# Altium schematic sheet SDRAM.SchDoc
size Tabloid; ApprovedBy: NA
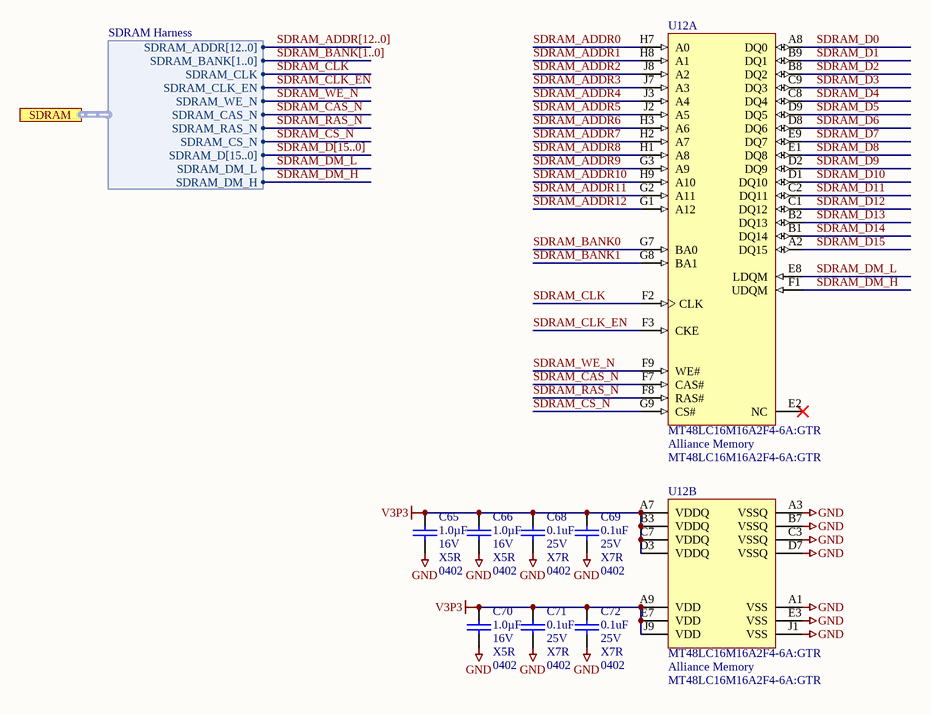
[diagram p0: SDRAM.SchDoc]

## Parts
C65  Capacitance: 1.0µF  Voltage - Rated: 16V  Temperature Coefficient: X5R  Package / Case: 0402  [C_0402]  (hidden comment: 1.0uF)
C66  Capacitance: 1.0µF  Voltage - Rated: 16V  Temperature Coefficient: X5R  Package / Case: 0402  [C_0402]  (hidden comment: 1.0uF)
C68  Capacitance: 0.1uF  Voltage - Rated: 25V  Temperature Coefficient: X7R  Package / Case: 0402  [C_0402]  (hidden comment: C_0402_0.1UF_25V)
C69  Capacitance: 0.1uF  Voltage - Rated: 25V  Temperature Coefficient: X7R  Package / Case: 0402  [C_0402]  (hidden comment: C_0402_0.1UF_25V)
C70  Capacitance: 1.0µF  Voltage - Rated: 16V  Temperature Coefficient: X5R  Package / Case: 0402  [C_0402]  (hidden comment: 1.0uF)
C71  Capacitance: 0.1uF  Voltage - Rated: 25V  Temperature Coefficient: X7R  Package / Case: 0402  [C_0402]  (hidden comment: C_0402_0.1UF_25V)
C72  Capacitance: 0.1uF  Voltage - Rated: 25V  Temperature Coefficient: X7R  Package / Case: 0402  [C_0402]  (hidden comment: C_0402_0.1UF_25V)
U12  MT48LC16M16A2F4-6A:GTR  Manufacturer 1: Alliance Memory  [MICT-B4-54]  (parts A,B of 2)

## Ports
SDRAM (harness SDRAM Harness)

## Harnesses
SDRAM Harness: SDRAM_ADDR[12..0], SDRAM_BANK[1..0], SDRAM_CLK, SDRAM_CLK_EN, SDRAM_WE_N, SDRAM_CAS_N, SDRAM_RAS_N, SDRAM_CS_N, SDRAM_D[15..0], SDRAM_DM_L, SDRAM_DM_H

## Nets
GND: C65.1 C66.1 C68.1 C69.1 C70.1 C71.1 C72.1 U12.A1(VSS) U12.A3(VSSQ) U12.B7(VSSQ) U12.C3(VSSQ) U12.D7(VSSQ) U12.E3(VSS) U12.J1(VSS)
V3P3: C65.2 C66.2 C68.2 C69.2 C70.2 C71.2 C72.2 U12.A7(VDDQ) U12.A9(VDD) U12.B3(VDDQ) U12.C7(VDDQ) U12.D3(VDDQ) U12.E7(VDD) U12.J9(VDD)
SDRAM_ADDR0: U12.H7(A0)
SDRAM_ADDR1: U12.H8(A1)
SDRAM_ADDR2: U12.J8(A2)
SDRAM_ADDR3: U12.J7(A3)
SDRAM_ADDR4: U12.J3(A4)
SDRAM_ADDR5: U12.J2(A5)
SDRAM_ADDR6: U12.H3(A6)
SDRAM_ADDR7: U12.H2(A7)
SDRAM_ADDR8: U12.H1(A8)
SDRAM_ADDR9: U12.G3(A9)
SDRAM_ADDR10: U12.H9(A10)
SDRAM_ADDR11: U12.G2(A11)
SDRAM_ADDR12: U12.G1(A12)
SDRAM_BANK0: U12.G7(BA0)
SDRAM_BANK1: U12.G8(BA1)
SDRAM_CAS_N: U12.F7(CAS#) ; port SDRAM.SDRAM_CAS_N
SDRAM_CLK: U12.F2(CLK) ; port SDRAM.SDRAM_CLK
SDRAM_CLK_EN: U12.F3(CKE) ; port SDRAM.SDRAM_CLK_EN
SDRAM_CS_N: U12.G9(CS#) ; port SDRAM.SDRAM_CS_N
SDRAM_D0: U12.A8(DQ0)
SDRAM_D1: U12.B9(DQ1)
SDRAM_D2: U12.B8(DQ2)
SDRAM_D3: U12.C9(DQ3)
SDRAM_D4: U12.C8(DQ4)
SDRAM_D5: U12.D9(DQ5)
SDRAM_D6: U12.D8(DQ6)
SDRAM_D7: U12.E9(DQ7)
SDRAM_D8: U12.E1(DQ8)
SDRAM_D9: U12.D2(DQ9)
SDRAM_D10: U12.D1(DQ10)
SDRAM_D11: U12.C2(DQ11)
SDRAM_D12: U12.C1(DQ12)
SDRAM_D13: U12.B2(DQ13)
SDRAM_D14: U12.B1(DQ14)
SDRAM_D15: U12.A2(DQ15)
SDRAM_DM_H: U12.F1(UDQM) ; port SDRAM.SDRAM_DM_H
SDRAM_DM_L: U12.E8(LDQM) ; port SDRAM.SDRAM_DM_L
SDRAM_RAS_N: U12.F8(RAS#) ; port SDRAM.SDRAM_RAS_N
SDRAM_WE_N: U12.F9(WE#) ; port SDRAM.SDRAM_WE_N

Not connected (* = marked no-connect by the designer): U12 E2(NC)*

## Buses and harness runs
bus SDRAM_ADDR[12..0]
bus SDRAM_BANK[1..0]
bus SDRAM_D[15..0]

## Notes on the sheet
- Project:
- http://www.cospandesign.com
- Cospan Design
- Document:
- Engineer:
- Title:
- Client:
- Approved By:
- Revision:
- Date:
- Number:
- of

## Library data of the parts
C65 C66 C70 = C_0402_1.0UF_16V: CAP CER 1.0UF 16V X5R 0402; Manufacturer 1: Samsung; Manufacturer Part Number 1: CL05A105KO5NNNC; Description 1: Cap Ceramic 1uF 16V X5R 10% SMD 0402 85C Paper T/R; Tolerance: 10%; ComponentLink1URL: http://ds.yuden.co.jp/TYCOMPAS/ut/detail.do?productNo=EMK105BJ105KV-F&fileName=EMK105BJ105KV-F_SS&mode=specSheetDownload; ComponentLink1Description: http://ds.yuden.co.jp/TYCOMPAS/ut/detail.do?productNo=EMK105BJ105KV-F&fileName=EMK105BJ105KV-F_SS&mode=specSheetDownload; ComponentLink2URL: https://datasheet.ciiva.com/16207/cl05a105ko5nnnc-16207571.pdf; ComponentLink2Description: https://datasheet.ciiva.com/16207/cl05a105ko5nnnc-16207571.pdf; ComponentLink3URL: https://datasheet.ciiva.com/15195/getdatasheetpartid-355272-15195629.pdf; ComponentLink3Description: https://datasheet.ciiva.com/15195/getdatasheetpartid-355272-15195629.pdf; Supplier 1: Digi-Key; Supplier Part Number 1: 1276-1067-6-ND; Stock 1: 26908; Pricing 1: 1=0.1, 10=0.062, 100=0.0276, 500=0.01968, 1000=0.01547, 2500=0.01406, 5000=0.01294 (USD); Mount: Surface Mount; Case/Package: 0402; Case Code (Metric): 1005; Case Code (Imperial): 0402; Contact Plating: Tin; Min Operating Temperature: -55°C; Max Operating Temperature: 85°C; Dielectric: X5R; Packaging: Tape and Reel; Package Quantity: 1; Voltage Rating: 16V; Voltage: 16V; Length: 1mm; Height: 0.5mm; Width: 0.02inch; Thickness: 0.022inch; Depth: 0.5mm; Radiation Hardening: No
C68 C69 C71 C72 = C_0402_0.1UF_25V: CAP CER 0.1UF 25V X6S 0402; Manufacturer 1: Yageo; Manufacturer Part Number 1: CC0402KRX7R8BB104; Description 1: Cap Ceramic 0.1uF 25V X7R 10% SMD 0402 125C Paper T/R; Tolerance: 10%; Dissipation Factor: 3.5%; ComponentLink1URL: https://product.tdk.com/info/en/catalog/datasheets/mlcc_commercial_general_en.pdf; ComponentLink1Description: https://product.tdk.com/info/en/catalog/datasheets/mlcc_commercial_general_en.pdf; Supplier 1: Digi-Key; Supplier Part Number 1: 311-2077-1-ND; Stock 1: 0; Pricing 1: 1=0.1, 10=0.048, 100=0.0215, 500=0.01534, 1000=0.01205, 2500=0.01095, 5000=0.01007 (USD); Mount: Surface Mount; Case/Package: 0402; Case Code (Imperial): 0402; Case Code (Metric): 1005; Min Operating Temperature: -55°C; Max Operating Temperature: 125°C; Voltage Rating: 25V; Voltage Rating (DC): 25V; Packaging: Tape and Reel; Dielectric: X7R; Termination: SMD/SMT; Composition: Ceramic; Length: 1mm; Height: 0.5mm; Width: 0.02inch; Thickness: 0.022inch; Depth: 0.5mm; Radiation Hardening: No; Lead Free: Lead Free; Halogen Free: Halogen Free; ComponentLink2URL: https://datasheet.ciiva.com/11464/upy-gphc-x7r-6-3v-to-50v-8-11464889.pdf; ComponentLink2Description: https://datasheet.ciiva.com/11464/upy-gphc-x7r-6-3v-to-50v-8-11464889.pdf; ComponentLink3URL: https://datasheet.ciiva.com/13210/upy-gphc-x7r-6-3v-to-50v-8-12304-13210908.pdf; ComponentLink3Description: https://datasheet.ciiva.com/13210/upy-gphc-x7r-6-3v-to-50v-8-12304-13210908.pdf; ComponentLink4URL: https://datasheet.ciiva.com/17437/upy-gphc-x7r-6-3v-to-50v-8-17437357.pdf; ComponentLink4Description: https://datasheet.ciiva.com/17437/upy-gphc-x7r-6-3v-to-50v-8-17437357.pdf
U12 = U_MT48LC16M16A2F4-6A: 256Mb PC133 SDR SDRAM, 16Mb x 16, 6ns, 3.3V, 0 to 70 degC, 54-Ball VFBGA, Pb-Free; Description 1: IC SDRAM 256MBIT 6NS 54VFBGA; ComponentLink1URL: http://www.micron.com/; ComponentLink1Description: Manufacturer URL; ComponentLink2URL: http://www.micron.com/~/media/Documents/Products/Data%20Sheet/DRAM/256Mb_sdr.pdf; ComponentLink2Description: Datasheet; ComponentLink3Description: Package Specification; ComponentLink3URL: http://www.micron.com/~/media/Documents/Products/Data%20Sheet/DRAM/128Mbx16x32Mobile.pdf; Supplier 1: Digi-Key; Supplier Part Number 1: 1450-1350-6-ND; Stock 1: 3138; Pricing 1: 1=3.29, 10=2.955, 25=2.908, 50=2.9002, 100=2.5915, 250=2.50728, 500=2.49792, 1000=2.3264 (USD); Manufacturer Part Number 1: MT48LC16M16A2F4-6A:GTR